# Altium schematic sheet Holiday r2.SchDoc: MooresCloud Holiday - Main CPU
size A3; DrawnBy: KJM; Organization: Kean Electronics for MooresCloud; Revision: 2; SheetNumber: 1; SheetTotal: 2
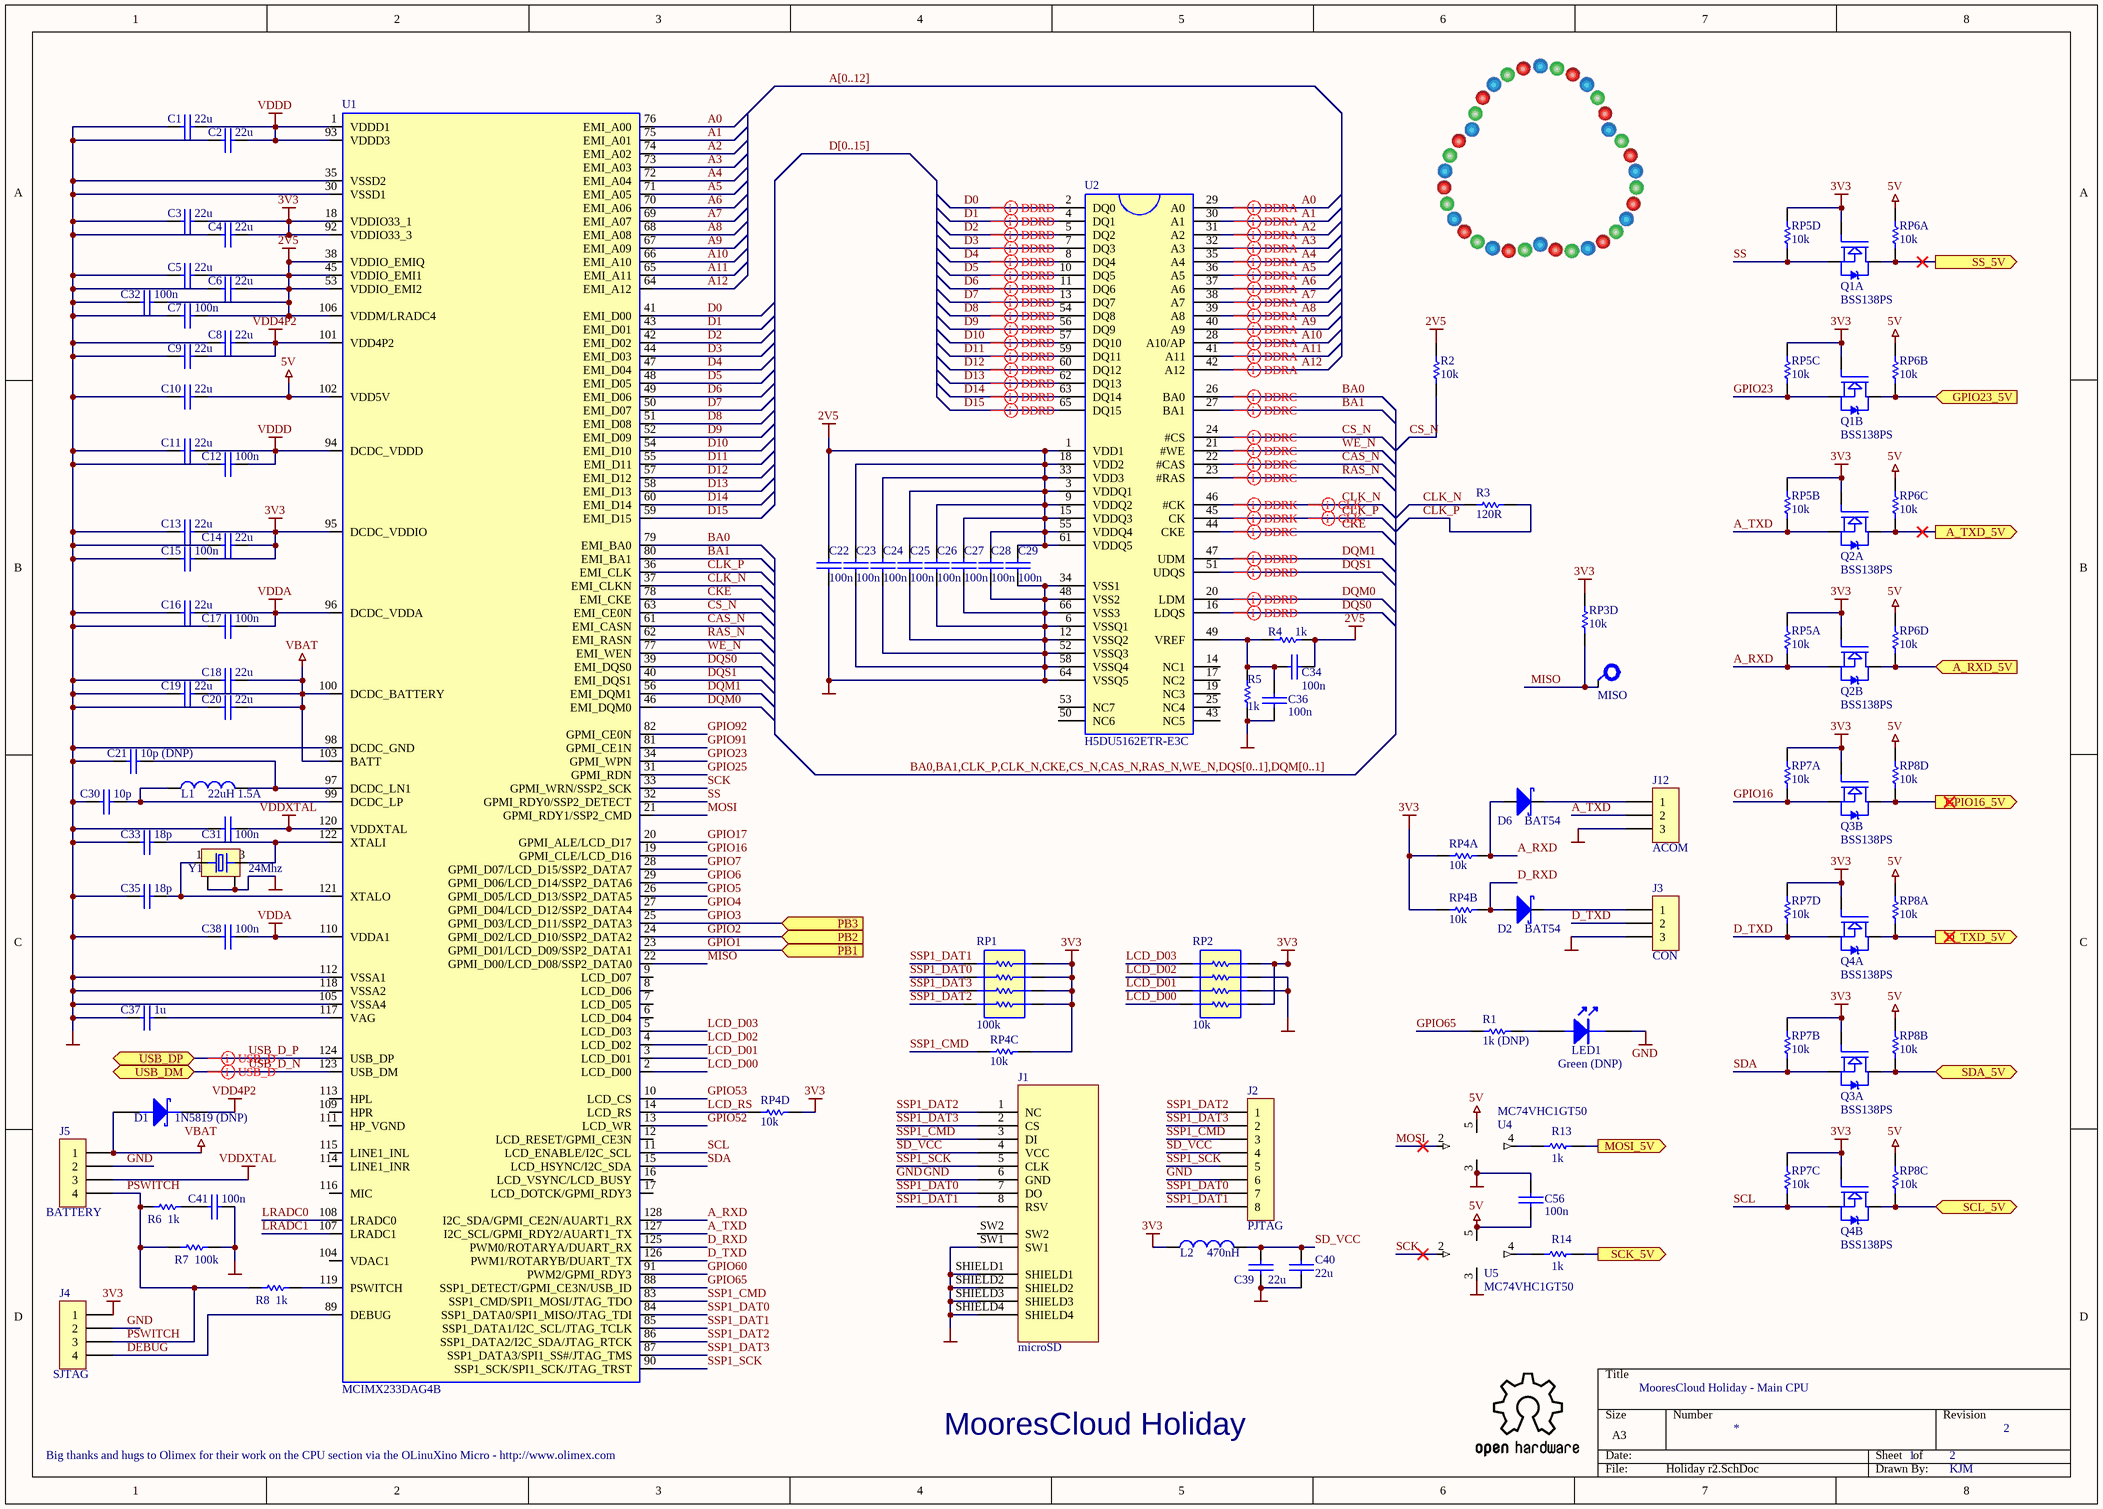
[diagram p0: Holiday r2.SchDoc]

## Parts
C1  22u  [ARA_0603]
C2  22u  [ARA_0603]
C3  22u  [ARA_0603]
C4  22u  [ARA_0603]
C5  22u  [ARA_0603]
C6  22u  [ARA_0603]
C7  100n  [ARA_0603]
C8  22u  [ARA_0603]
C9  22u  [ARA_0603]
C10  22u  [ARA_0603]
C11  22u  [ARA_0603]
C12  100n  [ARA_0603]
C13  22u  [ARA_0603]
C14  22u  [ARA_0603]
C15  100n  [ARA_0603]
C16  22u  [ARA_0603]
C17  100n  [ARA_0603]
C18  22u  [ARA_0603]
C19  22u  [ARA_0603]
C20  22u  [ARA_0603]
C21  10p (DNP)  [ARA_0603]
C22  100n  [ARA_0603]
C23  100n  [ARA_0603]
C24  100n  [ARA_0603]
C25  100n  [ARA_0603]
C26  100n  [ARA_0603]
C27  100n  [ARA_0603]
C28  100n  [ARA_0603]
C29  100n  [ARA_0603]
C30  10p  [ARA_0603]
C31  100n  [ARA_0603]
C32  100n  [ARA_0603]
C33  18p  [ARA_0603]
C34  100n  [ARA_0603]
C35  18p  [ARA_0603]
C36  100n  [ARA_0603]
C37  1u  [ARA_0603]
C38  100n  [ARA_0603]
C39  22u  [ARA_0603]
C40  22u  [ARA_0603]
C41  100n  [ARA_0603]
C56  100n  [ARA_0603]
D1  1N5819 (DNP)  [SOD-123]
D2  BAT54  [ARA_SOT-23]
D6  BAT54  [ARA_SOT-23]
J1  microSD  [MICROSD-47309-3751 WITH CARD]
J2  PJTAG  [53047-08]  (no BOM)
J3  CON  [HDR1X3]  (no BOM)
J4  SJTAG  [HDR1X4]  (no BOM)
J5  BATTERY  [HDR1X4]  (no BOM)
J12  ACOM  [HDR1X3]  (no BOM)
L1  22uH 1.5A  [RCL_L7078]
L2  470nH  [ARA_0805]
LED1  Green (DNP)  [LED_0805]
Q1  BSS138PS  [ARA_SOT-363]  (parts A,B of 2)
Q2  BSS138PS  [ARA_SOT-363]  (parts A,B of 2)
Q3  BSS138PS  [ARA_SOT-363]  (parts A,B of 2)
Q4  BSS138PS  [ARA_SOT-363]  (parts A,B of 2)
R1  1k (DNP)  [ARA_0603]
R2  10k  [ARA_0603]
R3  120R  [ARA_0603]
R4  1k  [ARA_0603]
R5  1k  [ARA_0603]
R6  1k  [ARA_0603]
R7  100k  [ARA_0603]
R8  1k  [ARA_0603]
R13  1k  [ARA_0603]
R14  1k  [ARA_0603]
RP1  100k  [RESPACK_0603x4]
RP2  10k  [RESPACK_0603x4]
RP3  10k  [RESPACK_0603x4]  (part D of 4)
RP4  10k  [RESPACK_0603x4]  (parts A,B,C,D of 4)
RP5  10k  [RESPACK_0603x4]  (parts A,B,C,D of 4)
RP6  10k  [RESPACK_0603x4]  (parts A,B,C,D of 4)
RP7  10k  [RESPACK_0603x4]  (parts A,B,C,D of 4)
RP8  10k  [RESPACK_0603x4]  (parts A,B,C,D of 4)
TP1  MISO  [SMD_TESTTERMINAL]  (no BOM)
U1  MCIMX233DAG4B  [LQFP128]
U2  H5DU5162ETR-E3C  [TSOP-II-66]
U4  MC74VHC1GT50  [ARA_SOT-23-5L]
U5  MC74VHC1GT50  [ARA_SOT-23-5L]
Y1  24Mhz  [CRYSTAL_ABMM2]

## Ports
A_RXD_5V (in), A_TXD_5V (out), D_TXD_5V (out), GPIO16_5V (out), GPIO23_5V (in), MOSI_5V (out), PB1 (in), PB2 (in), PB3 (in), SCK_5V (out), SCL_5V (bidir), SDA_5V (bidir), SS_5V (out), USB_DM (bidir), USB_DP (bidir)

## Nets
2V5: C5.1 C6.1 C7.1 C22.1 C23.1 C24.1 C25.1 C26.1 C27.1 C28.1 C29.1 C32.1 C34.1 R2.2 R4.2 U1.38(VDDIO_EMIQ) U1.45(VDDIO_EMI1) U1.53(VDDIO_EMI2) U1.106(VDDM/LRADC4) U2.1(VDD1) U2.3(VDDQ1) U2.9(VDDQ2) U2.15(VDDQ3) U2.18(VDD2) U2.33(VDD3) U2.55(VDDQ4) U2.61(VDDQ5)
3V3: C3.1 C4.1 C13.1 C14.1 C15.1 J4.1 L2.2 Q1.2(G1) Q1.5(G2) Q2.2(G1) Q2.5(G2) Q3.2(G1) Q3.5(G2) Q4.2(G1) Q4.5(G2) RP1.1.2 RP1.2.2 RP1.3.2 RP1.4.2 RP2.1.2 RP2.4.2 RP3.4.2 RP4.1.2 RP4.2.2 RP4.3.2 RP4.4.2 RP5.1.2 RP5.2.2 RP5.3.2 RP5.4.2 RP7.1.2 RP7.2.2 RP7.3.2 RP7.4.2 U1.18(VDDIO33_1) U1.92(VDDIO33_3) U1.95(DCDC_VDDIO)
5V: C10.1 C56.2 RP6.1.2 RP6.2.2 RP6.3.2 RP6.4.2 RP8.1.2 RP8.2.2 RP8.3.2 RP8.4.2 U1.102(VDD5V) U4.5(VCC) U5.5(VCC)
GND: C1.2 C2.2 C3.2 C4.2 C5.2 C6.2 C7.2 C8.2 C9.2 C10.2 C11.2 C12.2 C13.2 C14.2 C15.2 C16.2 C17.2 C18.2 C19.2 C20.2 C21.2 C22.2 C23.2 C24.2 C25.2 C26.2 C27.2 C28.2 C29.2 C30.2 C31.2 C32.2 C33.2 C35.2 C36.2 C37.2 C38.2 C39.2 C40.2 C41.2 C56.1 J1.6(GND) J1.SHIELD1 J1.SHIELD2 J1.SHIELD3 J1.SHIELD4 J1.SW1 J2.6 J3.3 J4.2 J5.2 J12.3 LED1.K R5.2 R7.1 RP2.2.2 RP2.3.2 U1.30(VSSD1) U1.35(VSSD2) U1.98(DCDC_GND) U1.105(VSSA4) U1.112(VSSA1) U1.118(VSSA2) U2.6(VSSQ1) U2.12(VSSQ2) U2.34(VSS1) U2.48(VSS2) U2.52(VSSQ3) U2.58(VSSQ4) U2.64(VSSQ5) U2.66(VSS3) U4.3(GND) U5.3(GND) Y1.2 Y1.4
VBAT: C18.1 C19.1 C20.1 D1.1(A) J5.1 U1.100(DCDC_BATTERY) U1.103(BATT)
VDD4P2: C8.1 C9.1 D1.2(K) U1.101(VDD4P2)
VDDA: C16.1 C17.1 C38.1 U1.96(DCDC_VDDA) U1.110(VDDA1)
VDDD: C1.1 C2.1 C11.1 C12.1 U1.1(VDDD1) U1.93(VDDD3) U1.94(DCDC_VDDD)
VDDXTAL: C31.1 J5.3 U1.120(VDDXTAL)
A0: U1.76(EMI_A00) U2.29(A0)
A1: U1.75(EMI_A01) U2.30(A1)
A2: U1.74(EMI_A02) U2.31(A2)
A3: U1.73(EMI_A03) U2.32(A3)
A4: U1.72(EMI_A04) U2.35(A4)
A5: U1.71(EMI_A05) U2.36(A5)
A6: U1.70(EMI_A06) U2.37(A6)
A7: U1.69(EMI_A07) U2.38(A7)
A8: U1.68(EMI_A08) U2.39(A8)
A9: U1.67(EMI_A09) U2.40(A9)
A10: U1.66(EMI_A10) U2.28(A10/AP)
A11: U1.65(EMI_A11) U2.41(A11)
A12: U1.64(EMI_A12) U2.42(A12)
A_RXD: D6.1(A) Q2.4(S2) RP4.1.1 RP5.1.1 U1.128(I2C_SDA/GPMI_CE2N/AUART1_RX)
A_RXD_5V: Q2.3(D2) RP6.4.1 ; port A_RXD_5V
A_TXD: J12.2 Q2.1(S1) RP5.2.1 U1.127(I2C_SCL/GPMI_RDY2/AUART1_TX)
A_TXD_5V: Q2.6(D1) RP6.3.1 ; port A_TXD_5V
BA0: U1.79(EMI_BA0) U2.26(BA0)
BA1: U1.80(EMI_BA1) U2.27(BA1)
CAS_N: U1.61(EMI_CASN) U2.22(#CAS)
CKE: U1.78(EMI_CKE) U2.44(CKE)
CLK_N: R3.1 U1.37(EMI_CLKN) U2.46(#CK)
CLK_P: R3.2 U1.36(EMI_CLK) U2.45(CK)
CS_N: R2.1 U1.63(EMI_CE0N) U2.24(#CS)
D0: U1.41(EMI_D00) U2.2(DQ0)
D1: U1.43(EMI_D01) U2.4(DQ1)
D2: U1.42(EMI_D02) U2.5(DQ2)
D3: U1.44(EMI_D03) U2.7(DQ3)
D4: U1.47(EMI_D04) U2.8(DQ4)
D5: U1.48(EMI_D05) U2.10(DQ5)
D6: U1.49(EMI_D06) U2.11(DQ6)
D7: U1.50(EMI_D07) U2.13(DQ7)
D8: U1.51(EMI_D08) U2.54(DQ8)
D9: U1.52(EMI_D09) U2.56(DQ9)
D10: U1.54(EMI_D10) U2.57(DQ10)
D11: U1.55(EMI_D11) U2.59(DQ11)
D12: U1.57(EMI_D12) U2.60(DQ12)
D13: U1.58(EMI_D13) U2.62(DQ13)
D14: U1.60(EMI_D14) U2.63(DQ14)
D15: U1.59(EMI_D15) U2.65(DQ15)
D_RXD: D2.1(A) RP4.2.1 U1.125(PWM0/ROTARYA/DUART_RX)
D_TXD: J3.2 Q4.1(S1) RP7.4.1 U1.126(PWM1/ROTARYB/DUART_TX)
D_TXD_5V: Q4.6(D1) RP8.1.1 ; port D_TXD_5V
DEBUG: J4.4 U1.89(DEBUG)
DQM0: U1.46(EMI_DQM0) U2.20(LDM)
DQM1: U1.56(EMI_DQM1) U2.47(UDM)
DQS0: U1.39(EMI_DQS0) U2.16(LDQS)
DQS1: U1.40(EMI_DQS1) U2.51(UDQS)
GPIO1: U1.23(GPMI_D01/LCD_D09/SSP2_DATA1) ; port PB1
GPIO2: U1.24(GPMI_D02/LCD_D10/SSP2_DATA2) ; port PB2
GPIO3: U1.25(GPMI_D03/LCD_D11/SSP2_DATA3) ; port PB3
GPIO4: U1.27(GPMI_D04/LCD_D12/SSP2_DATA4)
GPIO5: U1.26(GPMI_D05/LCD_D13/SSP2_DATA5)
GPIO6: U1.29(GPMI_D06/LCD_D14/SSP2_DATA6)
GPIO7: U1.28(GPMI_D07/LCD_D15/SSP2_DATA7)
GPIO16: Q3.4(S2) RP7.1.1 U1.19(GPMI_CLE/LCD_D16)
GPIO16_5V: Q3.3(D2) RP8.4.1 ; port GPIO16_5V
GPIO17: U1.20(GPMI_ALE/LCD_D17)
GPIO23: Q1.4(S2) RP5.3.1 U1.34(GPMI_WPN)
GPIO23_5V: Q1.3(D2) RP6.2.1 ; port GPIO23_5V
GPIO25: U1.31(GPMI_RDN)
GPIO52: U1.13(LCD_WR)
GPIO53: U1.10(LCD_CS)
GPIO60: U1.91(PWM2/GPMI_RDY3)
GPIO65: R1.2 U1.88(SSP1_DETECT/GPMI_CE3N/USB_ID)
GPIO91: U1.81(GPMI_CE1N)
GPIO92: U1.82(GPMI_CE0N)
LCD_D00: RP2.4.1 U1.2(LCD_D00)
LCD_D01: RP2.3.1 U1.3(LCD_D01)
LCD_D02: RP2.2.1 U1.4(LCD_D02)
LCD_D03: RP2.1.1 U1.5(LCD_D03)
LCD_RS: RP4.4.1 U1.14(LCD_RS)
LRADC0: U1.108(LRADC0)
LRADC1: U1.107(LRADC1)
MISO: RP3.4.1 TP1.1 U1.22(GPMI_D00/LCD_D08/SSP2_DATA0)
MOSI: U1.21(GPMI_RDY1/SSP2_CMD) U4.2(IN)
MOSI_5V: R13.1 ; port MOSI_5V
PSWITCH: J4.3 J5.4 R6.2 R7.2 R8.2
RAS_N: U1.62(EMI_RASN) U2.23(#RAS)
SCK: U1.33(GPMI_WRN/SSP2_SCK) U5.2(IN)
SCK_5V: R14.1 ; port SCK_5V
SCL: Q4.4(S2) RP7.3.1 U1.11(LCD_ENABLE/I2C_SCL)
SCL_5V: Q4.3(D2) RP8.3.1 ; port SCL_5V
SD_VCC: C39.1 C40.1 J1.4(VCC) J2.4 L2.1
SDA: Q3.1(S1) RP7.2.1 U1.15(LCD_HSYNC/I2C_SDA)
SDA_5V: Q3.6(D1) RP8.2.1 ; port SDA_5V
SS: Q1.1(S1) RP5.4.1 U1.32(GPMI_RDY0/SSP2_DETECT)
SS_5V: Q1.6(D1) RP6.1.1 ; port SS_5V
SSP1_CMD: J1.3(DI) J2.3 RP4.3.1 U1.83(SSP1_CMD/SPI1_MOSI/JTAG_TDO)
SSP1_DAT0: J1.7(DO) J2.7 RP1.2.1 U1.84(SSP1_DATA0/SPI1_MISO/JTAG_TDI)
SSP1_DAT1: J1.8(RSV) J2.8 RP1.1.1 U1.85(SSP1_DATA1/I2C_SCL/JTAG_TCLK)
SSP1_DAT2: J1.1(NC) J2.1 RP1.4.1 U1.86(SSP1_DATA2/I2C_SDA/JTAG_RTCK)
SSP1_DAT3: J1.2(CS) J2.2 RP1.3.1 U1.87(SSP1_DATA3/SPI1_SS#/JTAG_TMS)
SSP1_SCK: J1.5(CLK) J2.5 U1.90(SSP1_SCK/SPI1_SCK/JTAG_TRST)
USB_D_N: U1.123(USB_DM) ; port USB_DM
USB_D_P: U1.124(USB_DP) ; port USB_DP
WE_N: U1.77(EMI_WEN) U2.21(#WE)
NetC21_1: C21.1 L1.1 U1.97(DCDC_LN1)
NetC30_1: C30.1 L1.2 U1.99(DCDC_LP)
NetC33_1: C33.1 U1.122(XTALI) Y1.3
NetC34_2: C34.2 C36.1 R4.1 R5.1 U2.49(VREF)
NetC35_1: C35.1 U1.121(XTALO) Y1.1
NetC37_1: C37.1 U1.117(VAG)
NetC41_1: C41.1 R6.1
NetD2_2: D2.2(K) J3.1
NetD6_2: D6.2(K) J12.1
NetLED1_A: LED1.A R1.1
NetR8_1: R8.1 U1.119(PSWITCH)
NetR13_2: R13.2 U4.4(OUT)
NetR14_2: R14.2 U5.4(OUT)

Not connected (* = marked no-connect by the designer): J1 SW2; U1 6(LCD_D04) 7(LCD_D05) 8(LCD_D06) 9(LCD_D07) 12(LCD_RESET/GPMI_CE3N) 16(LCD_VSYNC/LCD_BUSY) 17(LCD_DOTCK/GPMI_RDY3) 104(VDAC1) 109(HPR) 111(HP_VGND) 113(HPL) 114(LINE1_INR) 115(LINE1_INL) 116(MIC); U2 14(NC1) 17(NC2) 19(NC3) 25(NC4) 43(NC5) 50(NC6) 53(NC7); U4 1; U5 1

## Buses and harness runs
bus A[0..12]
bus BA0,BA1,CLK_P,CLK_N,CKE,CS_N,CAS_N,RAS_N,WE_N,DQS[0..1],DQM[0..1]
bus D[0..15]

## Layout directives
net class DDR_DATA: D0, D1, D2, D3, D4, D5, D6, D7, D8, D9, D10, D11, D12, D13, D14, D15, DQM0, DQM1, DQS0, DQS1
net class DDR_ADDR: A0, A1, A2, A3, A4, A5, A6, A7, A8, A9, A10, A11, A12
net class DDR_CLK: CLK_N, CLK_P
differential pair: CLK_N, CLK_P, USB_D_N, USB_D_P
net class DDR_CTL: BA0, BA1, CAS_N, CKE, CS_N, RAS_N, WE_N

## Notes on the sheet
- Big thanks and hugs to Olimex for their work on the CPU section via the OLinuXino Micro - http://www.olimex.com
- MooresCloud Holiday

## Library data of the parts
C1-C6 C8-C11 C13 C14 C16 C18-C20 C39 C40 = CAP: Capacitor; 1.Manufacturer: TDK; 2.MfgNo: C1608X5R0J226M080AC; 4.CatNo: 445-8028-1-ND; 9.UnitCost: 0.0816; 3.Supplier: Digikey
C7 C12 C15 C17 C22-C29 C31 C32 C34 C36 C38 C41 C56 = CAP: Capacitor; 1.Manufacturer: Yageo; 4.CatNo: 311-1343-2-ND; 2.MfgNo: CC0603ZRY5V9BB104; 9.UnitCost: 0.0034; 3.Supplier: Digikey
C21 C30 = CAP: Capacitor; 1.Manufacturer: Murata; 4.CatNo: 490-1403-1-ND; 2.MfgNo: GRM1885C1H100JA01D; 9.UnitCost: 0.008; 3.Supplier: Digikey
C33 C35 = CAP: Capacitor; 1.Manufacturer: Murata; 2.MfgNo: GRM1885C1H180JA01D; 4.CatNo: 490-1409-2-ND; 9.UnitCost: 0.008; 3.Supplier: Digikey
C37 = CAP: Capacitor; 1.Manufacturer: Yageo; 4.CatNo: 311-1372-2-ND; 2.MfgNo: CC0603ZRY5V7BB105; 9.UnitCost: 0.0083; 3.Supplier: Digikey
D1 = DIODE SCHOTTKY: Schottky Diode 1N5819HW (DNP); 1.Manufacturer: Diodes Inc; 2.MfgNo: 1N5819HW-7-F; 4.CatNo: 1N5819HW-FDITR-ND; 9.UnitCost: 0.08; 3.Supplier: Digikey
D2 D6 = BAT54: Schottky Diode; pin to pad: 2>3; 1.Manufacturer: Fairchild; 4.CatNo: BAT54FSTR-ND; 9.UnitCost: 0.027; 2.MfgNo: BAT54; 3.Supplier: Digikey
J1 = microSD: microSD Socket Push/Pull; pin to pad: SHIELD1>G1 SHIELD2>G1 SHIELD3>G2 SHIELD4>G2 SW1>G3 SW2>G4; 1.Manufacturer: Molex; 2.MfgNo: 473093751; 4.CatNo: WM3974TR-ND; 9.UnitCost: 0.90; 3.Supplier: Digikey
J2 = CON8: Connector; 1.Manufacturer: DNP; 9.UnitCost: 0
J3 J12 = CON3: Connector; 1.Manufacturer: DNP; 9.UnitCost: 0
J4 J5 = CON4: Connector; 1.Manufacturer: DNP; 9.UnitCost: 0
L1 = Inductor: 1.Manufacturer: Taiyo Yuden; 2.MfgNo: NR6045T220M; 4.CatNo: 587-2082-1-ND; 9.UnitCost: 0.12; 3.Supplier: Digikey
L2 = Inductor: Ferrite; 1.Manufacturer: Abracon; 2.MfgNo: AISC-0805-R47J-T; 4.CatNo: 535-10509-1-ND; 9.UnitCost: 0.10; 3.Supplier: Digikey
LED1 = LED: 1.Manufacturer: Kingbright; 4.CatNo: 754-1131-1-ND; 9.UnitCost: 0.0611; 2.MfgNo: APT2012SGC; 3.Supplier: Digikey
Q1-Q4 = BSS138PS: Dual N Channel MOSFET; 1.Manufacturer: NXP; 4.CatNo: 568-8393-2-ND; 2.MfgNo: BSS138PS,115; 9.UnitCost: 0.07; 3.Supplier: Digikey
R1 R4-R6 R8 R13 R14 = Res Semi: Resistor; 1.Manufacturer: Yageo; 4.CatNo: 311-1.00KHRTR-ND; 2.MfgNo: RC0603FR-071KL; 9.UnitCost: 0.0017; 3.Supplier: Digikey
R2 = Res Semi: Resistor; 1.Manufacturer: Yageo; 9.UnitCost: 0.0017; 4.CatNo: 311-10.0KHRTR-ND; 2.MfgNo: RC0603FR-0710KL; 3.Supplier: Digikey
R3 = Res Semi: Resistor; 1.Manufacturer: Yageo; 4.CatNo: 311-120HRTR-ND; 2.MfgNo: RC0603FR-07120RL; 9.UnitCost: 0.0017; 3.Supplier: Digikey
R7 = Res Semi: Resistor; 1.Manufacturer: Yageo; 4.CatNo: 311-100KHRTR-ND; 2.MfgNo: RC0603FR-07100KL; 9.UnitCost: 0.0017; 3.Supplier: Digikey
RP1 = RESISTOR_PACK_4_1206: Resistor Pack 4x0603; 1.Manufacturer: Vishay Dale; 2.MfgNo: CRA06S083100KJTA; 4.CatNo: CRA6S8100KTR-ND; 9.UnitCost: 0.009; 3.Supplier: Digikey
RP2 = RESISTOR_PACK_4_1206: Resistor Pack 4x0603; 1.Manufacturer: Vishay Dale; 2.MfgNo: CRA06S08310K0JTA; 4.CatNo: CRA6S810KTR-ND; 9.UnitCost: 0.009; 3.Supplier: Digikey
RP3-RP8 = RESISTOR_PACK_4_1206_SPLIT: Resistor Pack 4x0603; 1.Manufacturer: Vishay Dale; 2.MfgNo: CRA06S08310K0JTA; 4.CatNo: CRA6S810KTR-ND; 9.UnitCost: 0.009; 3.Supplier: Digikey
TP1 = TESTTERMINAL: Test Point; 3.Supplier: *
U1 = MCIMX233DAG4B: Freescale i.MX233 128 pin LQFP package; 2.MfgNo: MCIMX233DAG4C; 4.CatNo: MCIMX233DAG4C-ND; 9.UnitCost: 4.880; 1.Manufacturer: Freescale; 3.Supplier: Digikey
U2 = H5DU5162ETR-E3C: SDRAM DDR400 66TSOP-II; 1.Manufacturer: Hynix; 9.UnitCost: 2.240; 2.MfgNo: H5DU5162ETR-E3C
U4 U5 = MC74VHC1GT50: CMOS Logic Level Shifter; 1.Manufacturer: On Semi; 2.MfgNo: M74VHC1GT50DTT1G; 4.CatNo: M74VHC1GT50DTT1GOSTR-ND; 9.UnitCost: 0.07; 3.Supplier: Digikey
Y1 = CRYSTAL_ABMM2: ABMM2 SMD Crystal; 1.Manufacturer: Abracon; 2.MfgNo: ABMM2-24.000MHZ-E2-T; 4.CatNo: 535-9638-2-ND; 9.UnitCost: 0.48; 3.Supplier: Digikey